# EAGLE schematic MiniMixer (EAGLE 6.6.0)
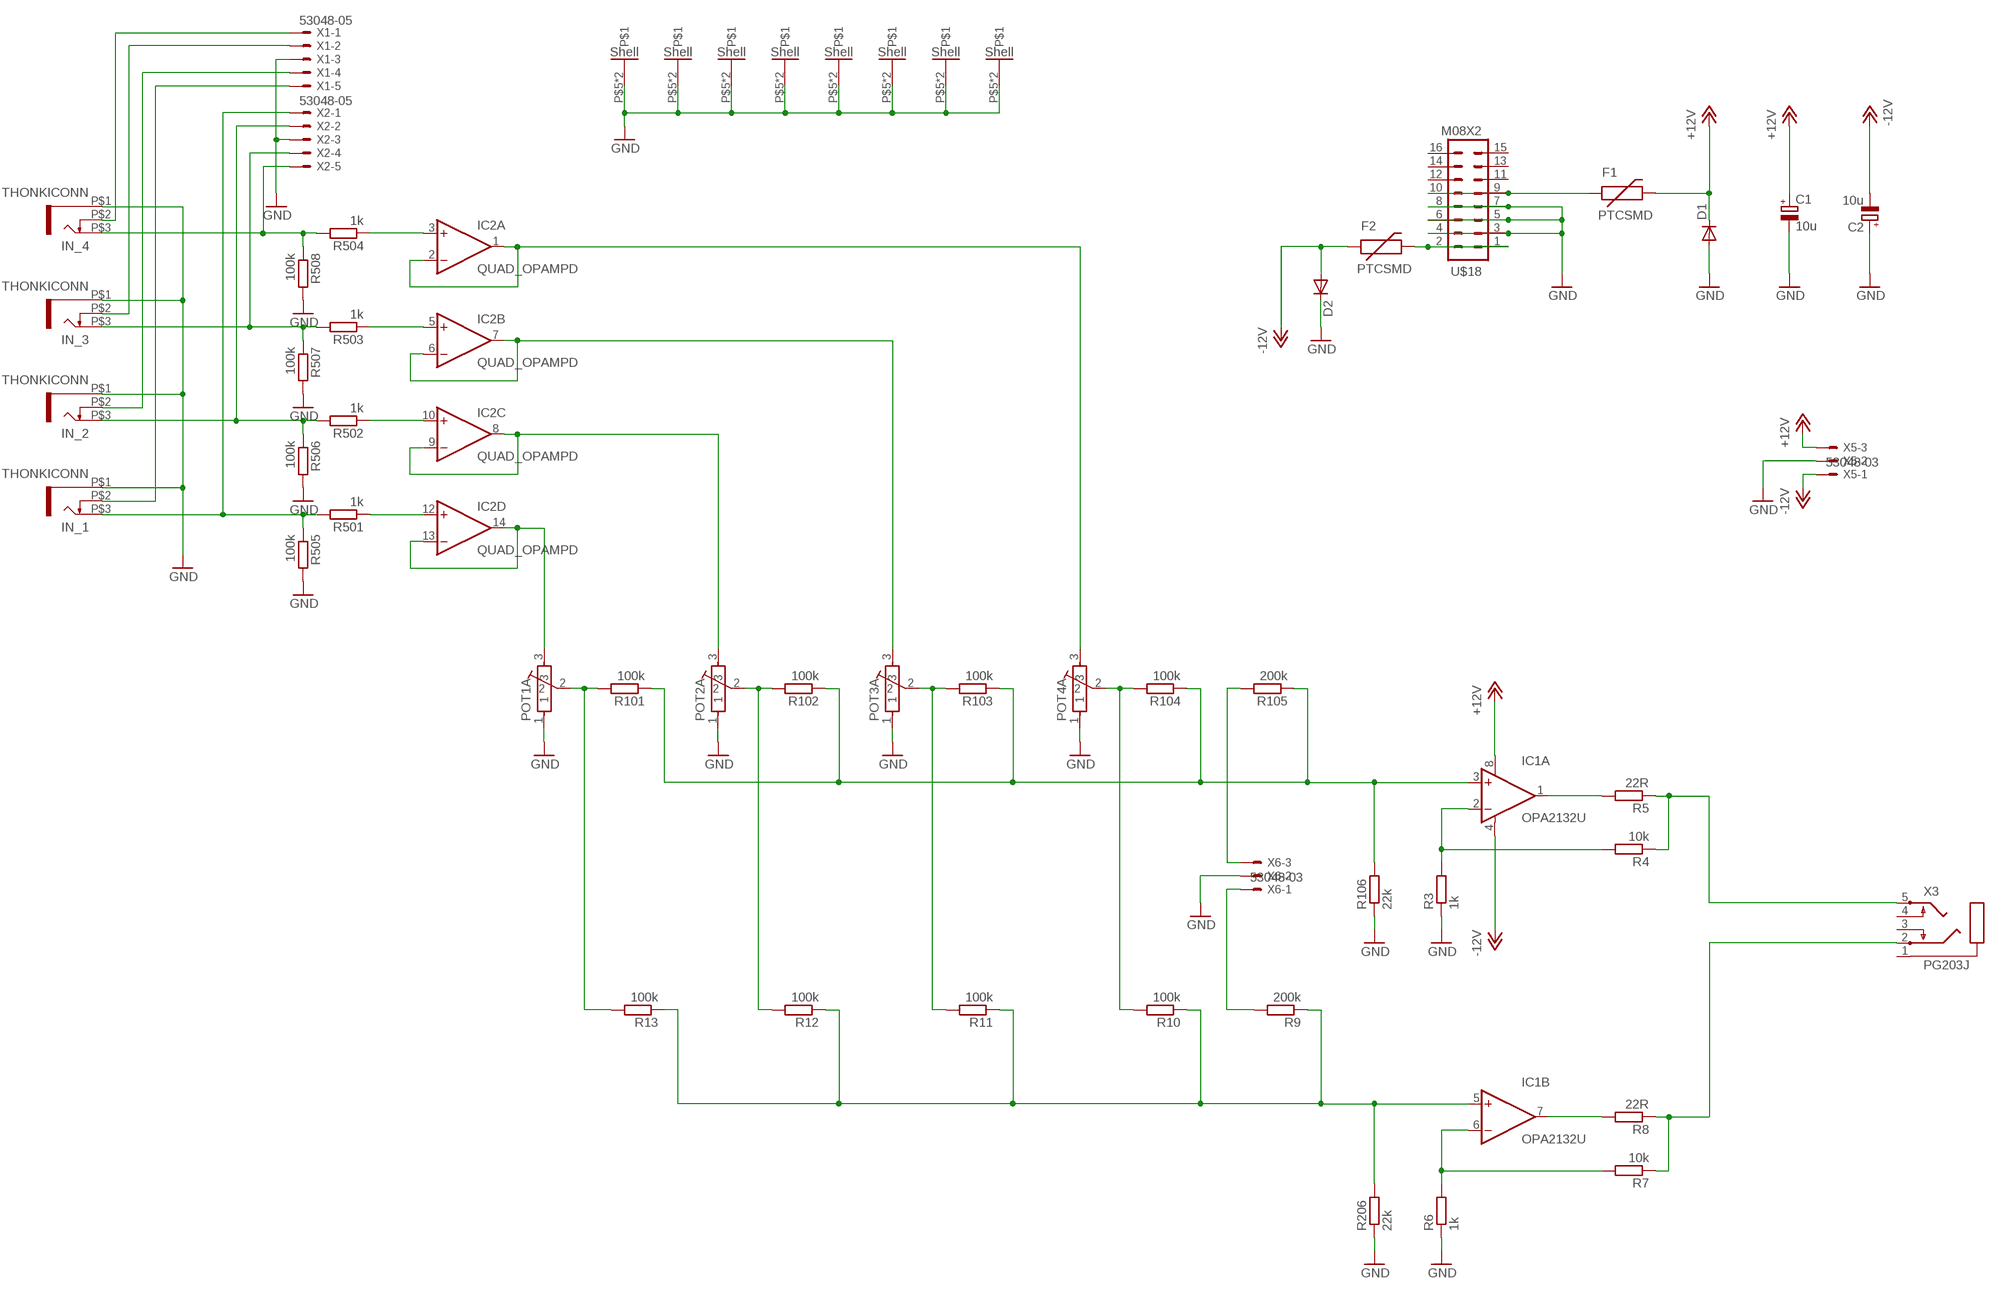
[diagram p0: schematic, sheet 1]

## Parts
C1  10u  CPOL-EU153CLV-0505  [153CLV-0505]
C2  10u  CPOL-EU153CLV-0505  [153CLV-0505]
D1  DIODESMA  [SMA-DIODE]
D2  DIODESMA  [SMA-DIODE]
F1  PTCSMD  [PTC-1206]
F2  PTCSMD  [PTC-1206]
IC1  OPA2132U  [SO08]
IC2  QUAD_OPAMPD  [SO14]
IN_1  THONKICONN  [THONKICONN]
IN_2  THONKICONN  [THONKICONN]
IN_3  THONKICONN  [THONKICONN]
IN_4  THONKICONN  [THONKICONN]
POT1A  POT-ALPS-RK09L1140  [POT-ALPS-RK09L1140]
POT1B  POT-ALPS-RK09L1140  [POT-ALPS-RK09L1140]
POT2A  POT-ALPS-RK09L1140  [POT-ALPS-RK09L1140]
POT2B  POT-ALPS-RK09L1140  [POT-ALPS-RK09L1140]
POT3A  POT-ALPS-RK09L1140  [POT-ALPS-RK09L1140]
POT3B  POT-ALPS-RK09L1140  [POT-ALPS-RK09L1140]
POT4A  POT-ALPS-RK09L1140  [POT-ALPS-RK09L1140]
POT4B  POT-ALPS-RK09L1140  [POT-ALPS-RK09L1140]
R3  1k  R-EU_0603  [0603]
R4  10k  R-EU_0603  [0603]
R5  22R  R-EU_0603  [0603]
R6  1k  R-EU_0603  [0603]
R7  10k  R-EU_0603  [0603]
R8  22R  R-EU_0603  [0603]
R9  200k  R-EU_R0603  [R0603]
R10  100k  R-EU_R0603  [R0603]
R11  100k  R-EU_R0603  [R0603]
R12  100k  R-EU_R0603  [R0603]
R13  100k  R-EU_R0603  [R0603]
R101  100k  R-EU_R0603  [R0603]
R102  100k  R-EU_R0603  [R0603]
R103  100k  R-EU_R0603  [R0603]
R104  100k  R-EU_R0603  [R0603]
R105  200k  R-EU_R0603  [R0603]
R106  22k  R-EU_0603  [0603]
R206  22k  R-EU_0603  [0603]
R501  1k  R-EU_R0603  [R0603]
R502  1k  R-EU_R0603  [R0603]
R503  1k  R-EU_R0603  [R0603]
R504  1k  R-EU_R0603  [R0603]
R505  100k  R-EU_R0603  [R0603]
R506  100k  R-EU_R0603  [R0603]
R507  100k  R-EU_R0603  [R0603]
R508  100k  R-EU_R0603  [R0603]
U$18  M08X2  [2X8]
X1  53048-05  [53048-05]
X2  53048-05  [53048-05]
X3  PG203J  [PG203J]
X5  53048-03  [53048-03]
X6  53048-03  [53048-03]

## Nets
+12V: C1.+ D1.C F1.2 IC1.8(A:V+) X5.3
-12V: C2.- D2.A F2.1 IC1.4(A:V-) X5.1
GND: C1.- C2.+ D1.A D2.C IN_1.P$1 IN_2.P$1 IN_3.P$1 IN_4.P$1 POT1A.1 POT1A.P$5 POT1A.P$6 POT1B.P$5 POT1B.P$6 POT2A.1 POT2A.P$5 POT2A.P$6 POT2B.P$5 POT2B.P$6 POT3A.1 POT3A.P$5 POT3A.P$6 POT3B.P$5 POT3B.P$6 POT4A.1 POT4A.P$5 POT4A.P$6 POT4B.P$5 POT4B.P$6 R3.1 R6.1 R106.1 R206.1 R505.2 R506.2 R507.2 R508.2 U$18.3 U$18.4 U$18.5 U$18.6 U$18.7 U$18.8 X1.3 X2.3 X5.2 X6.2
IN_1: IN_1.P$3 R501.2 R505.1 X2.1
IN_2: IN_2.P$3 R502.2 R506.1 X2.2
IN_3: IN_3.P$3 R503.2 R507.1 X2.4
IN_4: IN_4.P$3 R504.2 R508.1 X2.5
IN_A: R105.2 X6.3
IN_B: R9.2 X6.1
IN_SW_1: IN_1.P$2 X1.5
IN_SW_2: IN_2.P$2 X1.4
IN_SW_3: IN_3.P$2 X1.2
IN_SW_4: IN_4.P$2 X1.1
N$1: IC1.7(B:OUT) R8.2
N$2: IC1.1(A:OUT) R5.2
N$3: IC1.6(B:-IN) R6.2 R7.2
N$4: IC1.2(A:-IN) R3.2 R4.2
N$5: IC1.5(B:+IN) R9.1 R10.1 R11.1 R12.1 R13.1 R206.2
N$27: IC2.8(C:OUT) IC2.9(C:-IN) POT2A.3
N$29: POT1A.2 R13.2 R101.2
N$34: IC2.13(D:-IN) IC2.14(D:OUT) POT1A.3
N$42: IC2.3(A:+IN) R504.1
N$43: IC2.5(B:+IN) R503.1
N$47: POT4A.2 R10.2 R104.2
N$48: IC2.10(C:+IN) R502.1
N$49: POT3A.2 R11.2 R103.2
N$50: IC2.12(D:+IN) R501.1
N$51: POT2A.2 R12.2 R102.2
N$52: IC1.3(A:+IN) R101.1 R102.1 R103.1 R104.1 R105.1 R106.2
N$53: IC2.6(B:-IN) IC2.7(B:OUT) POT3A.3
N$56: F1.1 U$18.9 U$18.10
N$57: F2.2 U$18.1 U$18.2
N$58: IC2.1(A:OUT) IC2.2(A:-IN) POT4A.3
OUT: R4.1 R5.1 X3.5
OUT1: R7.1 R8.1 X3.2
Unconnected: POT1B.1 POT1B.2 POT1B.3 POT2B.1 POT2B.2 POT2B.3 POT3B.1 POT3B.2 POT3B.3 POT4B.1 POT4B.2 POT4B.3 U$18.11 U$18.12 U$18.13 U$18.14 U$18.15 U$18.16 X3.1 X3.3 X3.4

## Power pins joined to a net without a drawn wire
V+: IC2.4(P:V+)
V-: IC2.11(P:V-)

## Library data of the parts
C1 C2 = rcl:CPOL-EU: POLARIZED CAPACITOR, European symbol
D1 D2 = SparkFun:DIODE: Diode These are standard reverse protection diodes and small signal diodes. SMA package can handle up to about 1A. SOD-323 can handle about 200mA. What the SOD-323 package when ordering, there are some mfgs out there that are 5-pin packages.
F1 F2 = SparkFun:PTC: Resettable Fuse PTC Resettable Fuse. Spark Fun Electronics SKU : COM-08357
IC1 = burr-brown:OPA2132: High Speed FET-Input Operational Amplifiers< Product Folder:OPA2132; MF: TEXAS INSTRUMENTS; MPN: OPA2132U; OC_FARNELL: 1206934; OC_NEWARK: 80K6015
IC2 = adafruit:QUAD_OPAMP: OP AMP Standard quad package
IN_1-IN_4 = Rebel:THONKICONN
POT1A POT1B POT2A POT2B POT3A POT3B POT4A POT4B = Rebel:POT-ALPS-RK09L
R3-R8 R106 R206 = Rebel:R-EU_: RESISTOR, European symbol
R9-R13 R101-R105 R501-R508 = resistor:R-EU_: RESISTOR, European symbol
U$18 = SparkFun:M08X2
X1 X2 = con-molex:53?-05: CONNECTOR wire to board 1.25 mm (.049 inch) pitch header; MF: MOLEX; MPN: 53048-0510; OC_FARNELL: 9732926; OC_NEWARK: 57H4722
X3 = con-hirschmann:PG203J: MIC/HEADPHONE JACK KS-S stereo microphone/headphone jack PG203JN (Schukat); OC_FARNELL: unknown; OC_NEWARK: unknown
X5 X6 = con-molex:53?-03: CONNECTOR wire to board 1.25 mm (.049 inch) pitch header; MF: WALDOM/MOLEX; MPN: 53048-0310; OC_FARNELL: 9732918; OC_NEWARK: 38C9908